# Altium schematic sheet PZ254V-11-03P_C29376251_PZ254V-11-03P_C2937625.schdoc
size 124 x 101 mm
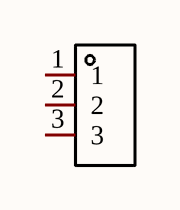
[diagram p0: PZ254V-11-03P_C29376251_PZ254V-11-03P_C2937625.schdoc]

## Parts
H?  PZ254V-11-03P  [HDR-TH_3P-P2.54-V-M]  (value not drawn)

## Nets

Not connected (* = marked no-connect by the designer): H? 1 2 3

## Library data of the parts
H? = PZ254V-11-03P: Manufacturer: XFCN(兴飞); Symbol: PZ254V-11-03P_C2937625; Add into BOM: yes; Pin Structure: 1x3P; Pitch: 2.54mm; Circluar Pins/Square Pins: 方针; Current Rating (Max): 3A; Voltage Rating (Max): 250V; Device: PZ254V-11-03P; LCSC Part Name: 间距:2.54mm 1x3P 直插 方针; Supplier Part: C2937625; Manufacturer Part: PZ254V-11-03P; Supplier Footprint: 插件,P=2.54mm; JLCPCB Part Class: Extended Part; Datasheet: https://atta.szlcsc.com/upload/public/pdf/source/20200309/C492402_8335C3D49C4E4C618838D59BB1D024C1.pdf; Supplier: LCSC; Convert to PCB: yes; Row Spacing: -; Mounting Type: 直插; Number of Rows: 单排; Number of Pins: 3P; Length of Mating Pin: 6mm; Insulation Height: 2.5mm; Length of End Connection Pin: 3mm; Operating Temperature Range: -40℃~+105℃; Color: 黑色